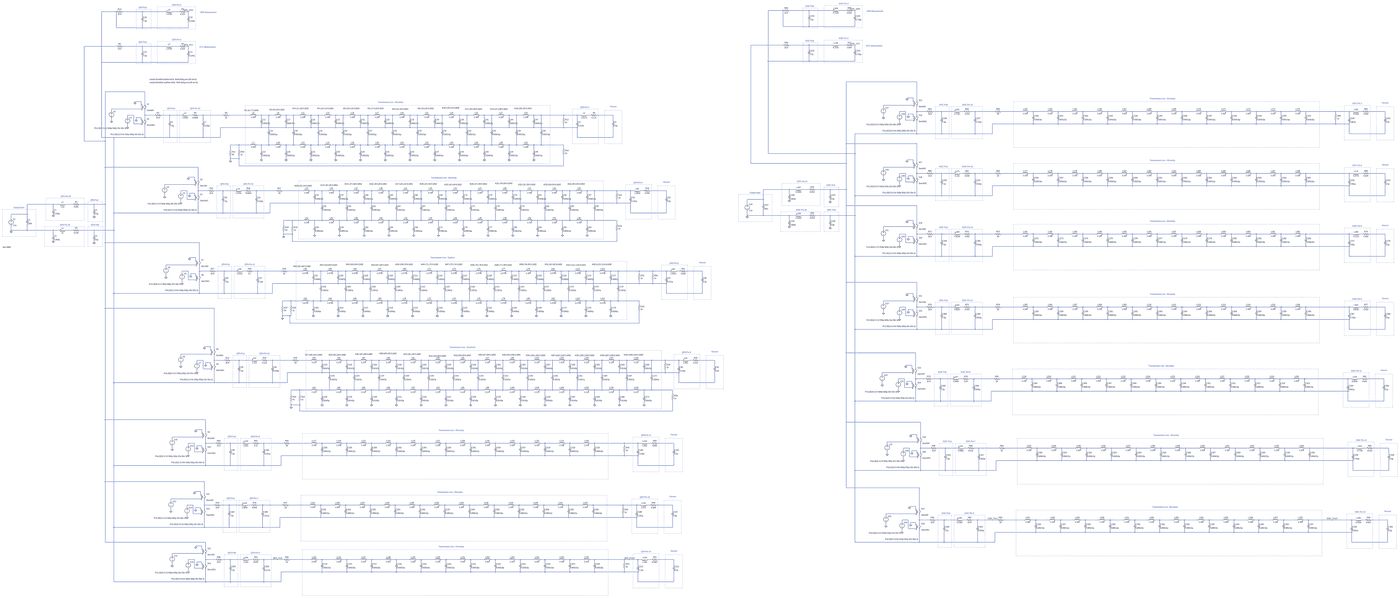
[diagram p0: schematic Assignment 02.asc, whole sheet]
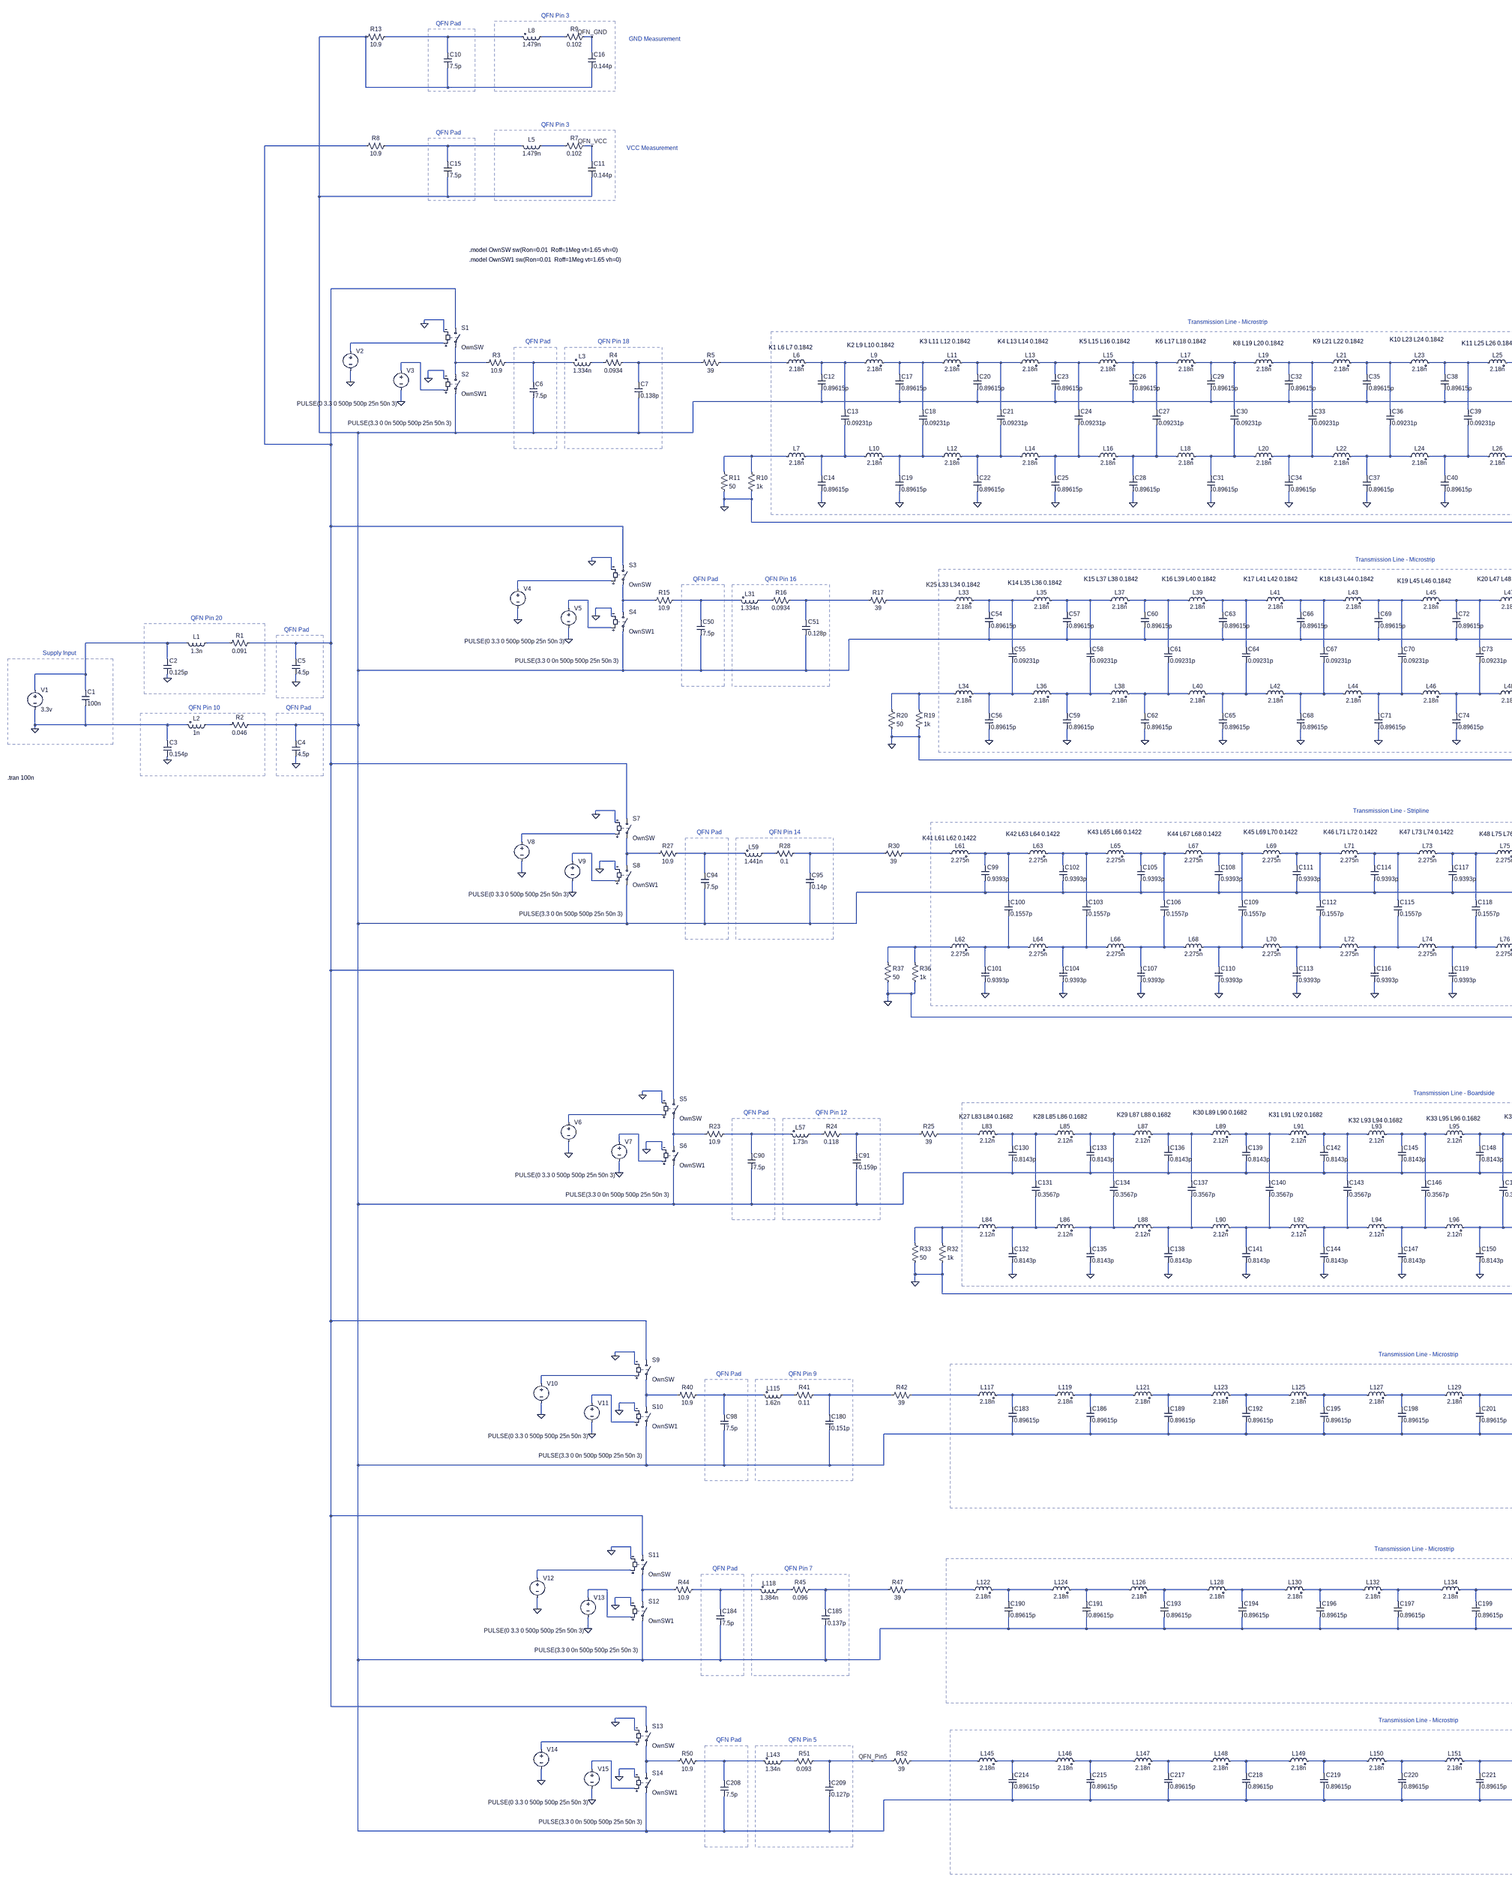
[diagram p1: schematic Assignment 02.asc, part, row 1 of 1, column 1 of 3]
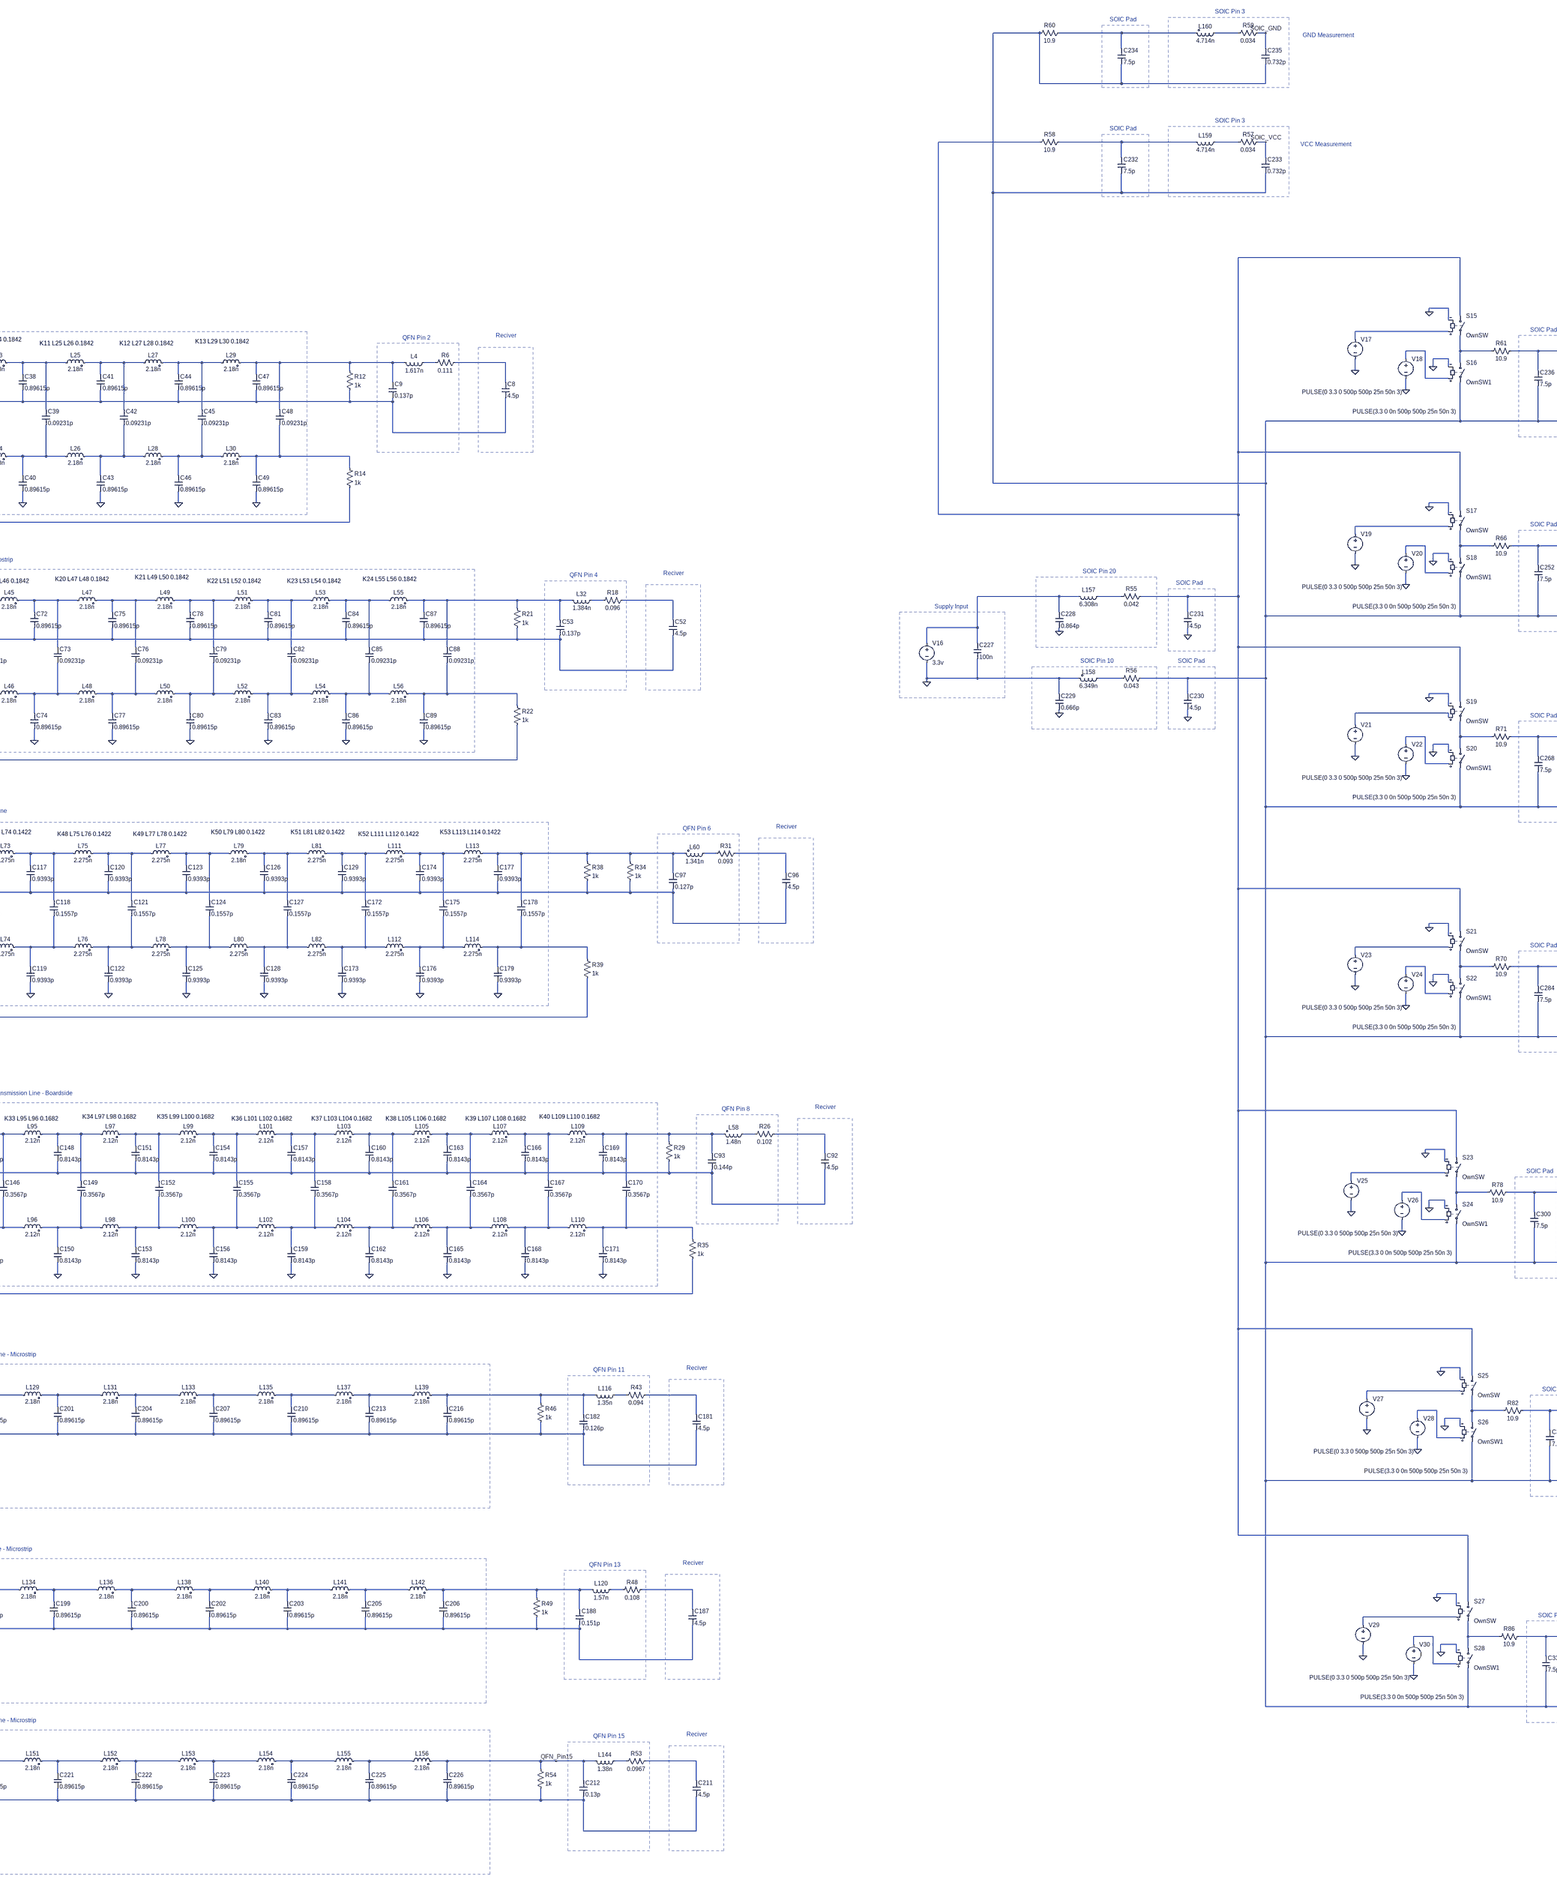
[diagram p2: schematic Assignment 02.asc, part, row 1 of 1, column 2 of 3]
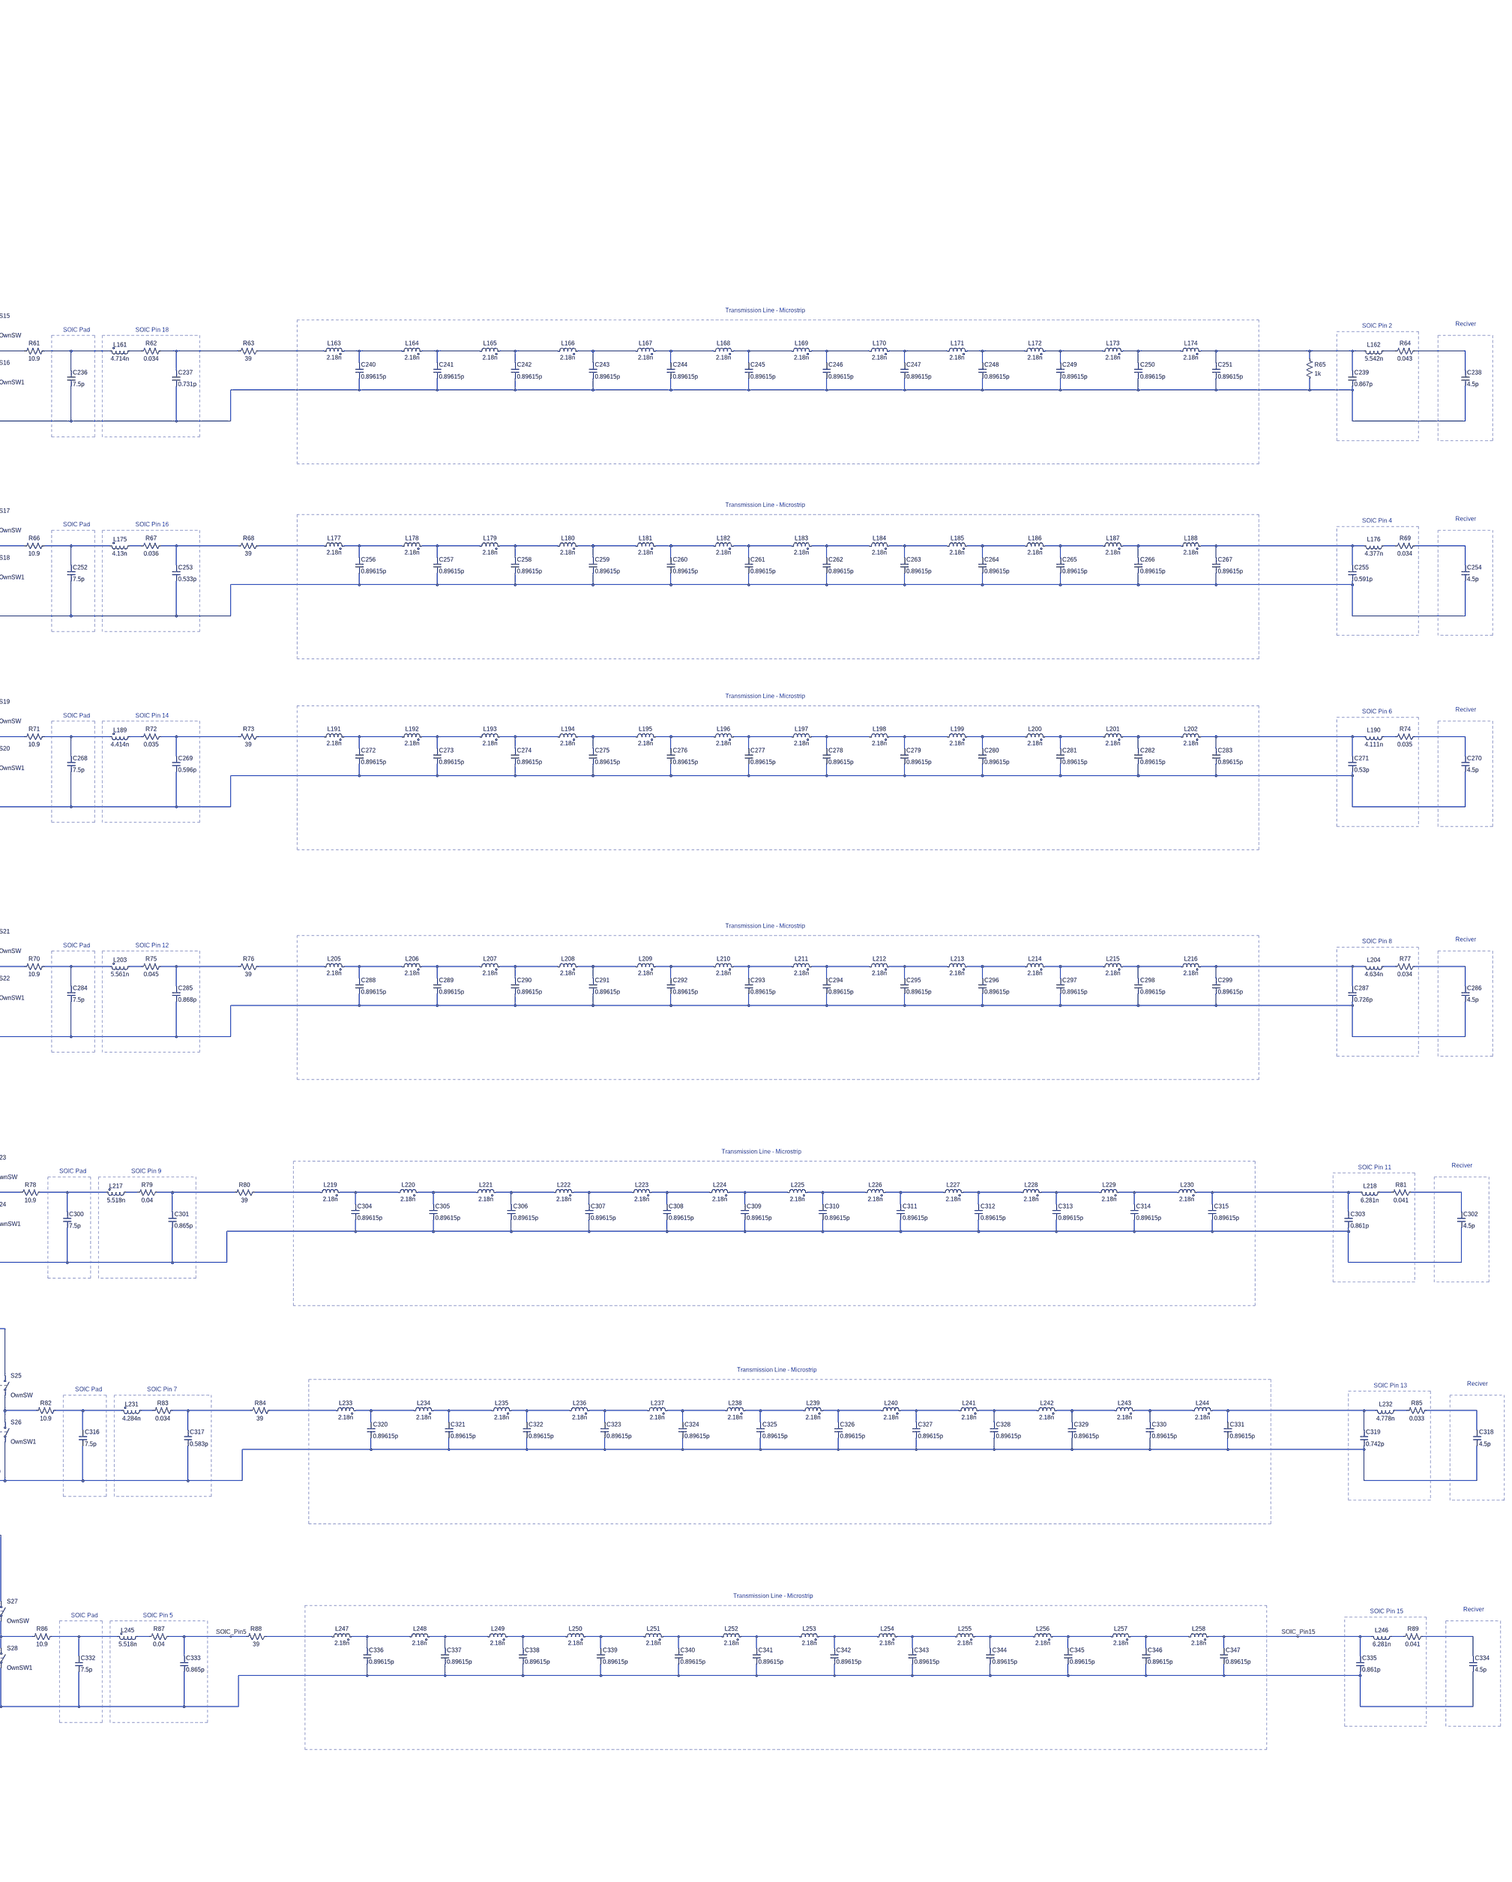
[diagram p3: schematic Assignment 02.asc, part, row 1 of 1, column 3 of 3]
* Assignment 02.asc
V1 N112 0 3.3v
C1 N112 0 100n
C2 N112 0 0.125p
L1 N113 N112 1.3n
R1 N010 N113 0.091
C3 0 0 0.154p
L2 N129 0 1n
R2 N004 N129 0.046
C4 N004 0 4.5p
C5 N010 0 4.5p
S1 N010 N036 N014 0 OwnSW
S2 N036 N004 N035 0 OwnSW1
R3 N037 N036 10.9
C6 N037 N004 7.5p
L3 N038 N037 1.334n
R4 N039 N038 0.0934
C7 N039 N004 0.138p
R5 N040 N039 39
L4 N053 N052 1.617n
R6 N054 N053 0.111
C8 N054 N004 4.5p
C9 N052 N004 0.137p
V2 N014 0 PULSE(0 3.3 0 500p 500p 25n 50n 3)
V3 N035 0 PULSE(3.3 0 0n 500p 500p 25n 50n 3)
L6 N040 N041 2.18n
C12 N041 N004 0.89615p
C13 N041 N056 0.09231p
C14 N056 0 0.89615p
L7 N055 N056 2.18n
R10 N055 0 1k
R11 N055 0 50
R12 N052 N004 1k
R14 N067 0 1k
L9 N041 N042 2.18n
C17 N042 N004 0.89615p
C18 N042 N057 0.09231p
C19 N057 0 0.89615p
L10 N056 N057 2.18n
L11 N042 N043 2.18n
C20 N043 N004 0.89615p
C21 N043 N058 0.09231p
C22 N058 0 0.89615p
L12 N057 N058 2.18n
L13 N043 N044 2.18n
C23 N044 N004 0.89615p
C24 N044 N059 0.09231p
C25 N059 0 0.89615p
L14 N058 N059 2.18n
L15 N044 N045 2.18n
C26 N045 N004 0.89615p
C27 N045 N060 0.09231p
C28 N060 0 0.89615p
L16 N059 N060 2.18n
L17 N045 N046 2.18n
C29 N046 N004 0.89615p
C30 N046 N061 0.09231p
C31 N061 0 0.89615p
L18 N060 N061 2.18n
L19 N046 N047 2.18n
C32 N047 N004 0.89615p
C33 N047 N062 0.09231p
C34 N062 0 0.89615p
L20 N061 N062 2.18n
L21 N047 N048 2.18n
C35 N048 N004 0.89615p
C36 N048 N063 0.09231p
C37 N063 0 0.89615p
L22 N062 N063 2.18n
L23 N048 N049 2.18n
C38 N049 N004 0.89615p
C39 N049 N064 0.09231p
C40 N064 0 0.89615p
L24 N063 N064 2.18n
L25 N049 N050 2.18n
C41 N050 N004 0.89615p
C42 N050 N065 0.09231p
C43 N065 0 0.89615p
L26 N064 N065 2.18n
L27 N050 N051 2.18n
C44 N051 N004 0.89615p
C45 N051 N066 0.09231p
C46 N066 0 0.89615p
L28 N065 N066 2.18n
L29 N051 N052 2.18n
C47 N052 N004 0.89615p
C48 N052 N067 0.09231p
C49 N067 0 0.89615p
L30 N066 N067 2.18n
L5 N012 N011 1.479n
R7 QFN_VCC N012 0.102
R8 N011 N010 10.9
C15 N011 N004 7.5p
C11 QFN_VCC N004 0.144p
L8 N006 N005 1.479n
R9 QFN_GND N006 0.102
R13 N005 N004 10.9
C10 N005 N004 7.5p
C16 QFN_GND N004 0.144p
S3 N010 N093 N089 0 OwnSW
S4 N093 N004 N092 0 OwnSW1
R15 N094 N093 10.9
C50 N094 N004 7.5p
L31 N095 N094 1.334n
R16 N096 N095 0.0934
C51 N096 N004 0.128p
R17 N097 N096 39
L32 N110 N109 1.384n
R18 N111 N110 0.096
C52 N111 N004 4.5p
C53 N109 N004 0.137p
V4 N089 0 PULSE(0 3.3 0 500p 500p 25n 50n 3)
V5 N092 0 PULSE(3.3 0 0n 500p 500p 25n 50n 3)
L33 N097 N098 2.18n
C54 N098 N004 0.89615p
C55 N098 N116 0.09231p
C56 N116 0 0.89615p
L34 N115 N116 2.18n
R19 N115 0 1k
R20 N115 0 50
R21 N109 N004 1k
R22 N127 0 1k
L35 N098 N099 2.18n
C57 N099 N004 0.89615p
C58 N099 N117 0.09231p
C59 N117 0 0.89615p
L36 N116 N117 2.18n
L37 N099 N100 2.18n
C60 N100 N004 0.89615p
C61 N100 N118 0.09231p
C62 N118 0 0.89615p
L38 N117 N118 2.18n
L39 N100 N101 2.18n
C63 N101 N004 0.89615p
C64 N101 N119 0.09231p
C65 N119 0 0.89615p
L40 N118 N119 2.18n
L41 N101 N102 2.18n
C66 N102 N004 0.89615p
C67 N102 N120 0.09231p
C68 N120 0 0.89615p
L42 N119 N120 2.18n
L43 N102 N103 2.18n
C69 N103 N004 0.89615p
C70 N103 N121 0.09231p
C71 N121 0 0.89615p
L44 N120 N121 2.18n
L45 N103 N104 2.18n
C72 N104 N004 0.89615p
C73 N104 N122 0.09231p
C74 N122 0 0.89615p
L46 N121 N122 2.18n
L47 N104 N105 2.18n
C75 N105 N004 0.89615p
C76 N105 N123 0.09231p
C77 N123 0 0.89615p
L48 N122 N123 2.18n
L49 N105 N106 2.18n
C78 N106 N004 0.89615p
C79 N106 N124 0.09231p
C80 N124 0 0.89615p
L50 N123 N124 2.18n
L51 N106 N107 2.18n
C81 N107 N004 0.89615p
C82 N107 N125 0.09231p
C83 N125 0 0.89615p
L52 N124 N125 2.18n
L53 N107 N108 2.18n
C84 N108 N004 0.89615p
C85 N108 N126 0.09231p
C86 N126 0 0.89615p
L54 N125 N126 2.18n
L55 N108 N109 2.18n
C87 N109 N004 0.89615p
C88 N109 N127 0.09231p
C89 N127 0 0.89615p
L56 N126 N127 2.18n
S5 N010 N209 N207 0 OwnSW
S6 N209 N004 N208 0 OwnSW1
R23 N210 N209 10.9
C90 N210 N004 7.5p
L57 N211 N210 1.73n
R24 N212 N211 0.118
C91 N212 N004 0.159p
R25 N213 N212 39
L58 N228 N227 1.48n
R26 N229 N228 0.102
C92 N229 N004 4.5p
C93 N227 N004 0.144p
V6 N207 0 PULSE(0 3.3 0 500p 500p 25n 50n 3)
V7 N208 0 PULSE(3.3 0 0n 500p 500p 25n 50n 3)
R29 N227 N004 1k
L83 N213 N214 2.12n
C130 N214 N004 0.8143p
C131 N214 N252 0.3567p
C132 N252 0 0.8143p
L84 N251 N252 2.12n
R32 N251 0 1k
R33 N251 0 50
L85 N214 N215 2.12n
C133 N215 N004 0.8143p
C134 N215 N253 0.3567p
C135 N253 0 0.8143p
L86 N252 N253 2.12n
L87 N215 N216 2.12n
C136 N216 N004 0.8143p
C137 N216 N254 0.3567p
C138 N254 0 0.8143p
L88 N253 N254 2.12n
L89 N216 N217 2.12n
C139 N217 N004 0.8143p
C140 N217 N255 0.3567p
C141 N255 0 0.8143p
L90 N254 N255 2.12n
L91 N217 N218 2.12n
C142 N218 N004 0.8143p
C143 N218 N256 0.3567p
C144 N256 0 0.8143p
L92 N255 N256 2.12n
L93 N218 N219 2.12n
C145 N219 N004 0.8143p
C146 N219 N257 0.3567p
C147 N257 0 0.8143p
L94 N256 N257 2.12n
L95 N219 N220 2.12n
C148 N220 N004 0.8143p
C149 N220 N258 0.3567p
C150 N258 0 0.8143p
L96 N257 N258 2.12n
L97 N220 N221 2.12n
C151 N221 N004 0.8143p
C152 N221 N259 0.3567p
C153 N259 0 0.8143p
L98 N258 N259 2.12n
L99 N221 N222 2.12n
C154 N222 N004 0.8143p
C155 N222 N260 0.3567p
C156 N260 0 0.8143p
L100 N259 N260 2.12n
L101 N222 N223 2.12n
C157 N223 N004 0.8143p
C158 N223 N261 0.3567p
C159 N261 0 0.8143p
L102 N260 N261 2.12n
L103 N223 N224 2.12n
C160 N224 N004 0.8143p
C161 N224 N262 0.3567p
C162 N262 0 0.8143p
L104 N261 N262 2.12n
L105 N224 N225 2.12n
C163 N225 N004 0.8143p
C164 N225 N263 0.3567p
C165 N263 0 0.8143p
L106 N262 N263 2.12n
L107 N225 N226 2.12n
C166 N226 N004 0.8143p
C167 N226 N264 0.3567p
C168 N264 0 0.8143p
L108 N263 N264 2.12n
L109 N226 N227 2.12n
C169 N227 N004 0.8143p
C170 N227 N265 0.3567p
C171 N265 0 0.8143p
L110 N264 N265 2.12n
R35 N265 0 1k
S7 N010 N152 N150 0 OwnSW
S8 N152 N004 N151 0 OwnSW1
R27 N153 N152 10.9
C94 N153 N004 7.5p
L59 N154 N153 1.441n
R28 N155 N154 0.1
C95 N155 N004 0.14p
L60 N170 N169 1.341n
R31 N171 N170 0.093
C96 N171 N004 4.5p
C97 N169 N004 0.127p
V8 N150 0 PULSE(0 3.3 0 500p 500p 25n 50n 3)
V9 N151 0 PULSE(3.3 0 0n 500p 500p 25n 50n 3)
R34 N169 N004 1k
L61 N156 N157 2.275n
C99 N157 N004 0.9393p
C100 N157 N173 0.1557p
C101 N173 0 0.9393p
L62 N172 N173 2.275n
R36 N172 0 1k
R37 N172 0 50
L63 N157 N158 2.275n
C102 N158 N004 0.9393p
C103 N158 N174 0.1557p
C104 N174 0 0.9393p
L64 N173 N174 2.275n
L65 N158 N159 2.275n
C105 N159 N004 0.9393p
C106 N159 N175 0.1557p
C107 N175 0 0.9393p
L66 N174 N175 2.275n
L67 N159 N160 2.275n
C108 N160 N004 0.9393p
C109 N160 N176 0.1557p
C110 N176 0 0.9393p
L68 N175 N176 2.275n
L69 N160 N161 2.275n
C111 N161 N004 0.9393p
C112 N161 N177 0.1557p
C113 N177 0 0.9393p
L70 N176 N177 2.275n
L71 N161 N162 2.275n
C114 N162 N004 0.9393p
C115 N162 N178 0.1557p
C116 N178 0 0.9393p
L72 N177 N178 2.275n
L73 N162 N163 2.275n
C117 N163 N004 0.9393p
C118 N163 N179 0.1557p
C119 N179 0 0.9393p
L74 N178 N179 2.275n
L75 N163 N164 2.275n
C120 N164 N004 0.9393p
C121 N164 N180 0.1557p
C122 N180 0 0.9393p
L76 N179 N180 2.275n
L77 N164 N165 2.275n
C123 N165 N004 0.9393p
C124 N165 N181 0.1557p
C125 N181 0 0.9393p
L78 N180 N181 2.275n
L79 N165 N166 2.18n
C126 N166 N004 0.9393p
C127 N166 N182 0.1557p
C128 N182 0 0.9393p
L80 N181 N182 2.275n
L81 N166 N167 2.275n
C129 N167 N004 0.9393p
C172 N167 N183 0.1557p
C173 N183 0 0.9393p
L82 N182 N183 2.275n
L111 N167 N168 2.275n
C174 N168 N004 0.9393p
C175 N168 N184 0.1557p
C176 N184 0 0.9393p
L112 N183 N184 2.275n
L113 N168 N169 2.275n
C177 N169 N004 0.9393p
C178 N169 N185 0.1557p
C179 N185 0 0.9393p
L114 N184 N185 2.275n
R38 N169 N004 1k
R39 N185 0 1k
R30 N156 N155 39
S9 N010 N269 N266 0 OwnSW
S10 N269 N004 N268 0 OwnSW1
R40 N270 N269 10.9
C98 N270 N004 7.5p
L115 N271 N270 1.62n
R41 N272 N271 0.11
C180 N272 N004 0.151p
R42 N273 N272 39
L116 N286 N285 1.35n
R43 N287 N286 0.094
C181 N287 N004 4.5p
C182 N285 N004 0.126p
V10 N266 0 PULSE(0 3.3 0 500p 500p 25n 50n 3)
V11 N268 0 PULSE(3.3 0 0n 500p 500p 25n 50n 3)
L117 N273 N274 2.18n
C183 N274 N004 0.89615p
R46 N285 N004 1k
L119 N274 N275 2.18n
C186 N275 N004 0.89615p
L121 N275 N276 2.18n
C189 N276 N004 0.89615p
L123 N276 N277 2.18n
C192 N277 N004 0.89615p
L125 N277 N278 2.18n
C195 N278 N004 0.89615p
L127 N278 N279 2.18n
C198 N279 N004 0.89615p
L129 N279 N280 2.18n
C201 N280 N004 0.89615p
L131 N280 N281 2.18n
C204 N281 N004 0.89615p
L133 N281 N282 2.18n
C207 N282 N004 0.89615p
L135 N282 N283 2.18n
C210 N283 N004 0.89615p
L137 N283 N284 2.18n
C213 N284 N004 0.89615p
L139 N284 N285 2.18n
C216 N285 N004 0.89615p
S11 N010 N310 N308 0 OwnSW
S12 N310 N004 N309 0 OwnSW1
R44 N311 N310 10.9
C184 N311 N004 7.5p
L118 N312 N311 1.384n
R45 N313 N312 0.096
C185 N313 N004 0.137p
R47 N314 N313 39
L120 N327 N326 1.57n
R48 N328 N327 0.108
C187 N328 N004 4.5p
C188 N326 N004 0.151p
V12 N308 0 PULSE(0 3.3 0 500p 500p 25n 50n 3)
V13 N309 0 PULSE(3.3 0 0n 500p 500p 25n 50n 3)
L122 N314 N315 2.18n
C190 N315 N004 0.89615p
R49 N326 N004 1k
L124 N315 N316 2.18n
C191 N316 N004 0.89615p
L126 N316 N317 2.18n
C193 N317 N004 0.89615p
L128 N317 N318 2.18n
C194 N318 N004 0.89615p
L130 N318 N319 2.18n
C196 N319 N004 0.89615p
L132 N319 N320 2.18n
C197 N320 N004 0.89615p
L134 N320 N321 2.18n
C199 N321 N004 0.89615p
L136 N321 N322 2.18n
C200 N322 N004 0.89615p
L138 N322 N323 2.18n
C202 N323 N004 0.89615p
L140 N323 N324 2.18n
C203 N324 N004 0.89615p
L141 N324 N325 2.18n
C205 N325 N004 0.89615p
L142 N325 N326 2.18n
C206 N326 N004 0.89615p
S13 N010 N350 N348 0 OwnSW
S14 N350 N004 N349 0 OwnSW1
R50 N351 N350 10.9
C208 N351 N004 7.5p
L143 N352 N351 1.34n
R51 QFN_Pin5 N352 0.093
C209 QFN_Pin5 N004 0.127p
R52 N353 QFN_Pin5 39
L144 N365 QFN_Pin15 1.38n
R53 N366 N365 0.0967
C211 N366 N004 4.5p
C212 QFN_Pin15 N004 0.13p
V14 N348 0 PULSE(0 3.3 0 500p 500p 25n 50n 3)
V15 N349 0 PULSE(3.3 0 0n 500p 500p 25n 50n 3)
L145 N353 N354 2.18n
C214 N354 N004 0.89615p
R54 QFN_Pin15 N004 1k
L146 N354 N355 2.18n
C215 N355 N004 0.89615p
L147 N355 N356 2.18n
C217 N356 N004 0.89615p
L148 N356 N357 2.18n
C218 N357 N004 0.89615p
L149 N357 N358 2.18n
C219 N358 N004 0.89615p
L150 N358 N359 2.18n
C220 N359 N004 0.89615p
L151 N359 N360 2.18n
C221 N360 N004 0.89615p
L152 N360 N361 2.18n
C222 N361 N004 0.89615p
L153 N361 N362 2.18n
C223 N362 N004 0.89615p
L154 N362 N363 2.18n
C224 N363 N004 0.89615p
L155 N363 N364 2.18n
C225 N364 N004 0.89615p
L156 N364 QFN_Pin15 2.18n
C226 QFN_Pin15 N004 0.89615p
V16 N090 0 3.3v
C227 N090 0 100n
C228 N090 0 0.864p
L157 N091 N090 6.308n
R55 N007 N091 0.042
C229 0 0 0.666p
L158 N114 0 6.349n
R56 N001 N114 0.043
C230 N001 0 4.5p
C231 N007 0 4.5p
L159 N009 N008 4.714n
R57 SOIC_VCC N009 0.034
R58 N008 N007 10.9
C232 N008 N001 7.5p
C233 SOIC_VCC N001 0.732p
L160 N003 N002 4.714n
R59 SOIC_GND N003 0.034
R60 N002 N001 10.9
C234 N002 N001 7.5p
C235 SOIC_GND N001 0.732p
S15 N007 N016 N013 0 OwnSW
S16 N016 N001 N015 0 OwnSW1
R61 N017 N016 10.9
C236 N017 N001 7.5p
L161 N018 N017 4.714n
R62 N019 N018 0.034
C237 N019 N001 0.731p
R63 N020 N019 39
L162 N033 N032 5.542n
R64 N034 N033 0.043
C238 N034 N001 4.5p
C239 N032 N001 0.867p
V17 N013 0 PULSE(0 3.3 0 500p 500p 25n 50n 3)
V18 N015 0 PULSE(3.3 0 0n 500p 500p 25n 50n 3)
L163 N020 N021 2.18n
C240 N021 N001 0.89615p
R65 N032 N001 1k
L164 N021 N022 2.18n
C241 N022 N001 0.89615p
L165 N022 N023 2.18n
C242 N023 N001 0.89615p
L166 N023 N024 2.18n
C243 N024 N001 0.89615p
L167 N024 N025 2.18n
C244 N025 N001 0.89615p
L168 N025 N026 2.18n
C245 N026 N001 0.89615p
L169 N026 N027 2.18n
C246 N027 N001 0.89615p
L170 N027 N028 2.18n
C247 N028 N001 0.89615p
L171 N028 N029 2.18n
C248 N029 N001 0.89615p
L172 N029 N030 2.18n
C249 N030 N001 0.89615p
L173 N030 N031 2.18n
C250 N031 N001 0.89615p
L174 N031 N032 2.18n
C251 N032 N001 0.89615p
S17 N007 N070 N068 0 OwnSW
S18 N070 N001 N069 0 OwnSW1
R66 N071 N070 10.9
C252 N071 N001 7.5p
L175 N072 N071 4.13n
R67 N073 N072 0.036
C253 N073 N001 0.533p
R68 N074 N073 39
L176 N087 N086 4.377n
R69 N088 N087 0.034
C254 N088 N001 4.5p
C255 N086 N001 0.591p
V19 N068 0 PULSE(0 3.3 0 500p 500p 25n 50n 3)
V20 N069 0 PULSE(3.3 0 0n 500p 500p 25n 50n 3)
L177 N074 N075 2.18n
C256 N075 N001 0.89615p
L178 N075 N076 2.18n
C257 N076 N001 0.89615p
L179 N076 N077 2.18n
C258 N077 N001 0.89615p
L180 N077 N078 2.18n
C259 N078 N001 0.89615p
L181 N078 N079 2.18n
C260 N079 N001 0.89615p
L182 N079 N080 2.18n
C261 N080 N001 0.89615p
L183 N080 N081 2.18n
C262 N081 N001 0.89615p
L184 N081 N082 2.18n
C263 N082 N001 0.89615p
L185 N082 N083 2.18n
C264 N083 N001 0.89615p
L186 N083 N084 2.18n
C265 N084 N001 0.89615p
L187 N084 N085 2.18n
C266 N085 N001 0.89615p
L188 N085 N086 2.18n
C267 N086 N001 0.89615p
S19 N007 N131 N128 0 OwnSW
S20 N131 N001 N130 0 OwnSW1
R71 N132 N131 10.9
C268 N132 N001 7.5p
L189 N133 N132 4.414n
R72 N134 N133 0.035
C269 N134 N001 0.596p
R73 N135 N134 39
L190 N148 N147 4.111n
R74 N149 N148 0.035
C270 N149 N001 4.5p
C271 N147 N001 0.53p
V21 N128 0 PULSE(0 3.3 0 500p 500p 25n 50n 3)
V22 N130 0 PULSE(3.3 0 0n 500p 500p 25n 50n 3)
L191 N135 N136 2.18n
C272 N136 N001 0.89615p
L192 N136 N137 2.18n
C273 N137 N001 0.89615p
L193 N137 N138 2.18n
C274 N138 N001 0.89615p
L194 N138 N139 2.18n
C275 N139 N001 0.89615p
L195 N139 N140 2.18n
C276 N140 N001 0.89615p
L196 N140 N141 2.18n
C277 N141 N001 0.89615p
L197 N141 N142 2.18n
C278 N142 N001 0.89615p
L198 N142 N143 2.18n
C279 N143 N001 0.89615p
L199 N143 N144 2.18n
C280 N144 N001 0.89615p
L200 N144 N145 2.18n
C281 N145 N001 0.89615p
L201 N145 N146 2.18n
C282 N146 N001 0.89615p
L202 N146 N147 2.18n
C283 N147 N001 0.89615p
S21 N007 N188 N186 0 OwnSW
S22 N188 N001 N187 0 OwnSW1
R70 N189 N188 10.9
C284 N189 N001 7.5p
L203 N190 N189 5.561n
R75 N191 N190 0.045
C285 N191 N001 0.868p
R76 N192 N191 39
L204 N205 N204 4.634n
R77 N206 N205 0.034
C286 N206 N001 4.5p
C287 N204 N001 0.726p
V23 N186 0 PULSE(0 3.3 0 500p 500p 25n 50n 3)
V24 N187 0 PULSE(3.3 0 0n 500p 500p 25n 50n 3)
L205 N192 N193 2.18n
C288 N193 N001 0.89615p
L206 N193 N194 2.18n
C289 N194 N001 0.89615p
L207 N194 N195 2.18n
C290 N195 N001 0.89615p
L208 N195 N196 2.18n
C291 N196 N001 0.89615p
L209 N196 N197 2.18n
C292 N197 N001 0.89615p
L210 N197 N198 2.18n
C293 N198 N001 0.89615p
L211 N198 N199 2.18n
C294 N199 N001 0.89615p
L212 N199 N200 2.18n
C295 N200 N001 0.89615p
L213 N200 N201 2.18n
C296 N201 N001 0.89615p
L214 N201 N202 2.18n
C297 N202 N001 0.89615p
L215 N202 N203 2.18n
C298 N203 N001 0.89615p
L216 N203 N204 2.18n
C299 N204 N001 0.89615p
S23 N007 N232 N230 0 OwnSW
S24 N232 N001 N231 0 OwnSW1
R78 N233 N232 10.9
C300 N233 N001 7.5p
L217 N234 N233 5.518n
R79 N235 N234 0.04
C301 N235 N001 0.865p
R80 N236 N235 39
L218 N249 N248 6.281n
R81 N250 N249 0.041
C302 N250 N001 4.5p
C303 N248 N001 0.861p
V25 N230 0 PULSE(0 3.3 0 500p 500p 25n 50n 3)
V26 N231 0 PULSE(3.3 0 0n 500p 500p 25n 50n 3)
L219 N236 N237 2.18n
C304 N237 N001 0.89615p
L220 N237 N238 2.18n
C305 N238 N001 0.89615p
L221 N238 N239 2.18n
C306 N239 N001 0.89615p
L222 N239 N240 2.18n
C307 N240 N001 0.89615p
L223 N240 N241 2.18n
C308 N241 N001 0.89615p
L224 N241 N242 2.18n
C309 N242 N001 0.89615p
L225 N242 N243 2.18n
C310 N243 N001 0.89615p
L226 N243 N244 2.18n
C311 N244 N001 0.89615p
L227 N244 N245 2.18n
C312 N245 N001 0.89615p
L228 N245 N246 2.18n
C313 N246 N001 0.89615p
L229 N246 N247 2.18n
C314 N247 N001 0.89615p
L230 N247 N248 2.18n
C315 N248 N001 0.89615p
S25 N007 N289 N267 0 OwnSW
S26 N289 N001 N288 0 OwnSW1
R82 N290 N289 10.9
C316 N290 N001 7.5p
L231 N291 N290 4.284n
R83 N292 N291 0.034
C317 N292 N001 0.583p
R84 N293 N292 39
L232 N306 N305 4.778n
R85 N307 N306 0.033
C318 N307 N001 4.5p
C319 N305 N001 0.742p
V27 N267 0 PULSE(0 3.3 0 500p 500p 25n 50n 3)
V28 N288 0 PULSE(3.3 0 0n 500p 500p 25n 50n 3)
L233 N293 N294 2.18n
C320 N294 N001 0.89615p
L234 N294 N295 2.18n
C321 N295 N001 0.89615p
L235 N295 N296 2.18n
C322 N296 N001 0.89615p
L236 N296 N297 2.18n
C323 N297 N001 0.89615p
L237 N297 N298 2.18n
C324 N298 N001 0.89615p
L238 N298 N299 2.18n
C325 N299 N001 0.89615p
L239 N299 N300 2.18n
C326 N300 N001 0.89615p
L240 N300 N301 2.18n
C327 N301 N001 0.89615p
L241 N301 N302 2.18n
C328 N302 N001 0.89615p
L242 N302 N303 2.18n
C329 N303 N001 0.89615p
L243 N303 N304 2.18n
C330 N304 N001 0.89615p
L244 N304 N305 2.18n
C331 N305 N001 0.89615p
S27 N007 N331 N329 0 OwnSW
S28 N331 N001 N330 0 OwnSW1
R86 N332 N331 10.9
C332 N332 N001 7.5p
L245 N333 N332 5.518n
R87 SOIC_Pin5 N333 0.04
C333 SOIC_Pin5 N001 0.865p
R88 N334 SOIC_Pin5 39
L246 N346 SOIC_Pin15 6.281n
R89 N347 N346 0.041
C334 N347 N001 4.5p
C335 SOIC_Pin15 N001 0.861p
V29 N329 0 PULSE(0 3.3 0 500p 500p 25n 50n 3)
V30 N330 0 PULSE(3.3 0 0n 500p 500p 25n 50n 3)
L247 N334 N335 2.18n
C336 N335 N001 0.89615p
L248 N335 N336 2.18n
C337 N336 N001 0.89615p
L249 N336 N337 2.18n
C338 N337 N001 0.89615p
L250 N337 N338 2.18n
C339 N338 N001 0.89615p
L251 N338 N339 2.18n
C340 N339 N001 0.89615p
L252 N339 N340 2.18n
C341 N340 N001 0.89615p
L253 N340 N341 2.18n
C342 N341 N001 0.89615p
L254 N341 N342 2.18n
C343 N342 N001 0.89615p
L255 N342 N343 2.18n
C344 N343 N001 0.89615p
L256 N343 N344 2.18n
C345 N344 N001 0.89615p
L257 N344 N345 2.18n
C346 N345 N001 0.89615p
L258 N345 SOIC_Pin15 2.18n
C347 SOIC_Pin15 N001 0.89615p
* Supply Input
* QFN Pin 20
* QFN Pin 10
* QFN Pad
* QFN Pad
* QFN Pad
* QFN Pin 18
* QFN Pin 2
* Reciver
.model OwnSW1 sw(Ron=0.01  Roff=1Meg vt=1.65 vh=0)
K1 L6 L7 0.1842
K2 L9 L10 0.1842
K3 L11 L12 0.1842
K4 L13 L14 0.1842
K5 L15 L16 0.1842
K6 L17 L18 0.1842
K8 L19 L20 0.1842
K9 L21 L22 0.1842
K10 L23 L24 0.1842
K11 L25 L26 0.1842
K12 L27 L28 0.1842
K13 L29 L30 0.1842
* Transmission Line - Microstrip
* QFN Pin 3
* QFN Pad
* QFN Pin 3
* QFN Pad
.model OwnSW sw(Ron=0.01  Roff=1Meg vt=1.65 vh=0)
.tran 100n
* VCC Measurement
* GND Measurement
* QFN Pad
* QFN Pin 16
* QFN Pin 4
* Reciver
K25 L33 L34 0.1842
K14 L35 L36 0.1842
K15 L37 L38 0.1842
K16 L39 L40 0.1842
K17 L41 L42 0.1842
K18 L43 L44 0.1842
K19 L45 L46 0.1842
K20 L47 L48 0.1842
K21 L49 L50 0.1842
K22 L51 L52 0.1842
K23 L53 L54 0.1842
K24 L55 L56 0.1842
* Transmission Line - Microstrip
* QFN Pad
* QFN Pin 12
* QFN Pin 8
* Reciver
K27 L83 L84 0.1682
K28 L85 L86 0.1682
K29 L87 L88 0.1682
K30 L89 L90 0.1682
K31 L91 L92 0.1682
K32 L93 L94 0.1682
K33 L95 L96 0.1682
K34 L97 L98 0.1682
K35 L99 L100 0.1682
K36 L101 L102 0.1682
K37 L103 L104 0.1682
K38 L105 L106 0.1682
K39 L107 L108 0.1682
K40 L109 L110 0.1682
* Transmission Line - Boardside
* QFN Pad
* QFN Pin 14
* QFN Pin 6
* Reciver
K41 L61 L62 0.1422
K42 L63 L64 0.1422
K43 L65 L66 0.1422
K44 L67 L68 0.1422
K45 L69 L70 0.1422
K46 L71 L72 0.1422
K47 L73 L74 0.1422
K48 L75 L76 0.1422
K49 L77 L78 0.1422
K50 L79 L80 0.1422
K51 L81 L82 0.1422
K52 L111 L112 0.1422
K53 L113 L114 0.1422
* Transmission Line - Stripline
* QFN Pad
* QFN Pin 9
* QFN Pin 11
* Reciver
* Transmission Line - Microstrip
* QFN Pad
* QFN Pin 7
* QFN Pin 13
* Reciver
* Transmission Line - Microstrip
* QFN Pad
* QFN Pin 5
* QFN Pin 15
* Reciver
* Transmission Line - Microstrip
* Supply Input
* SOIC Pin 20
* SOIC Pin 10
* SOIC Pad
* SOIC Pad
* SOIC Pin 3
* SOIC Pad
* SOIC Pin 3
* SOIC Pad
* VCC Measurement
* GND Measurement
* SOIC Pad
* SOIC Pin 18
* SOIC Pin 2
* Reciver
* Transmission Line - Microstrip
* SOIC Pad
* SOIC Pin 16
* SOIC Pin 4
* Reciver
* Transmission Line - Microstrip
* SOIC Pad
* SOIC Pin 14
* SOIC Pin 6
* Reciver
* Transmission Line - Microstrip
* SOIC Pad
* SOIC Pin 12
* SOIC Pin 8
* Reciver
* Transmission Line - Microstrip
* SOIC Pad
* SOIC Pin 9
* SOIC Pin 11
* Reciver
* Transmission Line - Microstrip
* SOIC Pad
* SOIC Pin 7
* SOIC Pin 13
* Reciver
* Transmission Line - Microstrip
* SOIC Pad
* SOIC Pin 5
* SOIC Pin 15
* Reciver
* Transmission Line - Microstrip
.backanno
.end